# EAGLE schematic 612_jetracer_esp32s3_030004 (EAGLE 9.6.2)
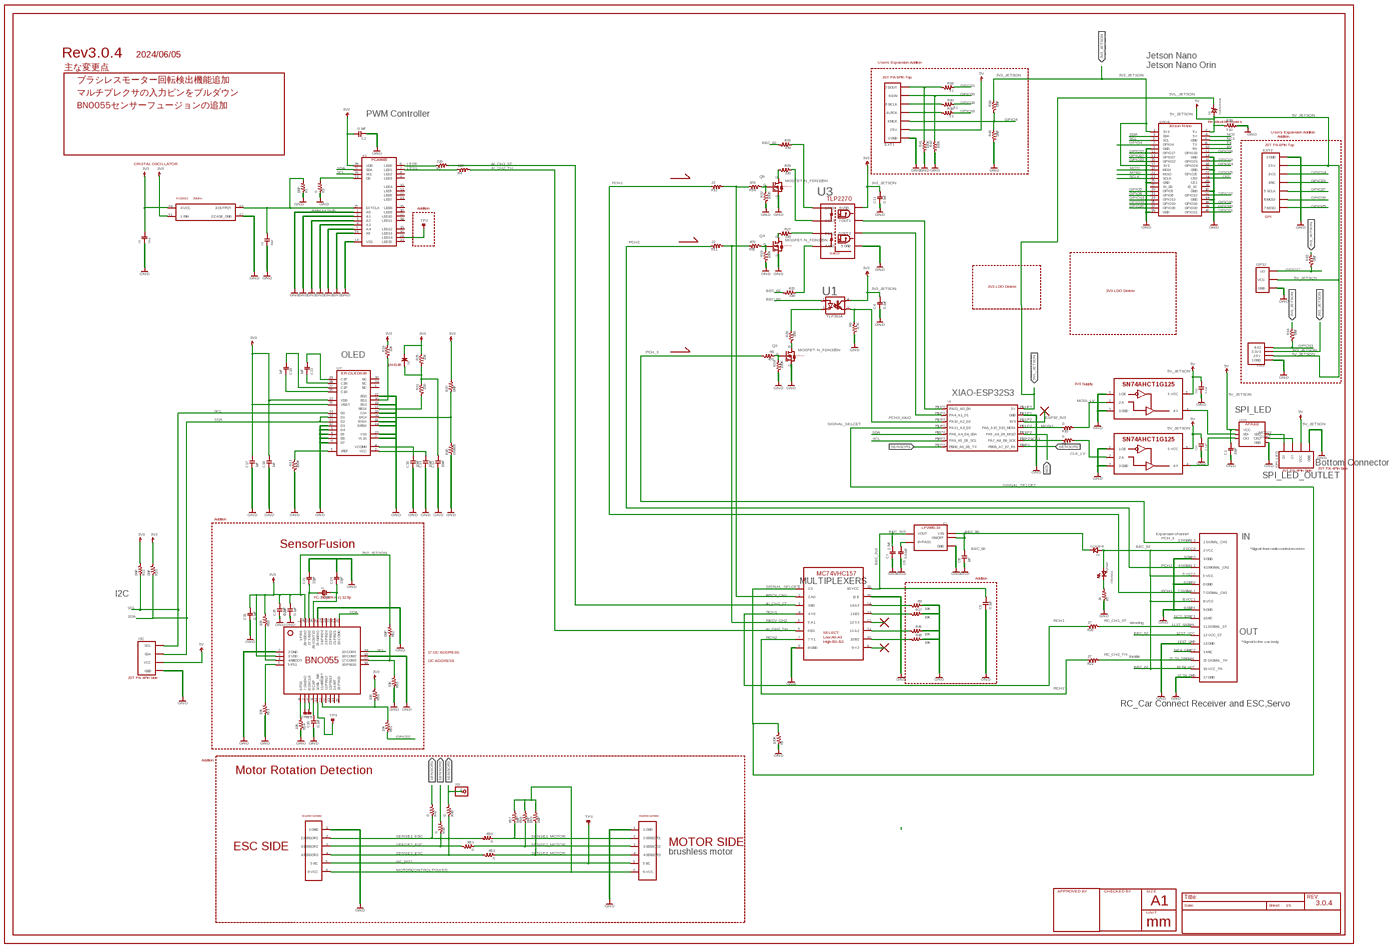
[diagram p0: schematic, sheet 1, overview]
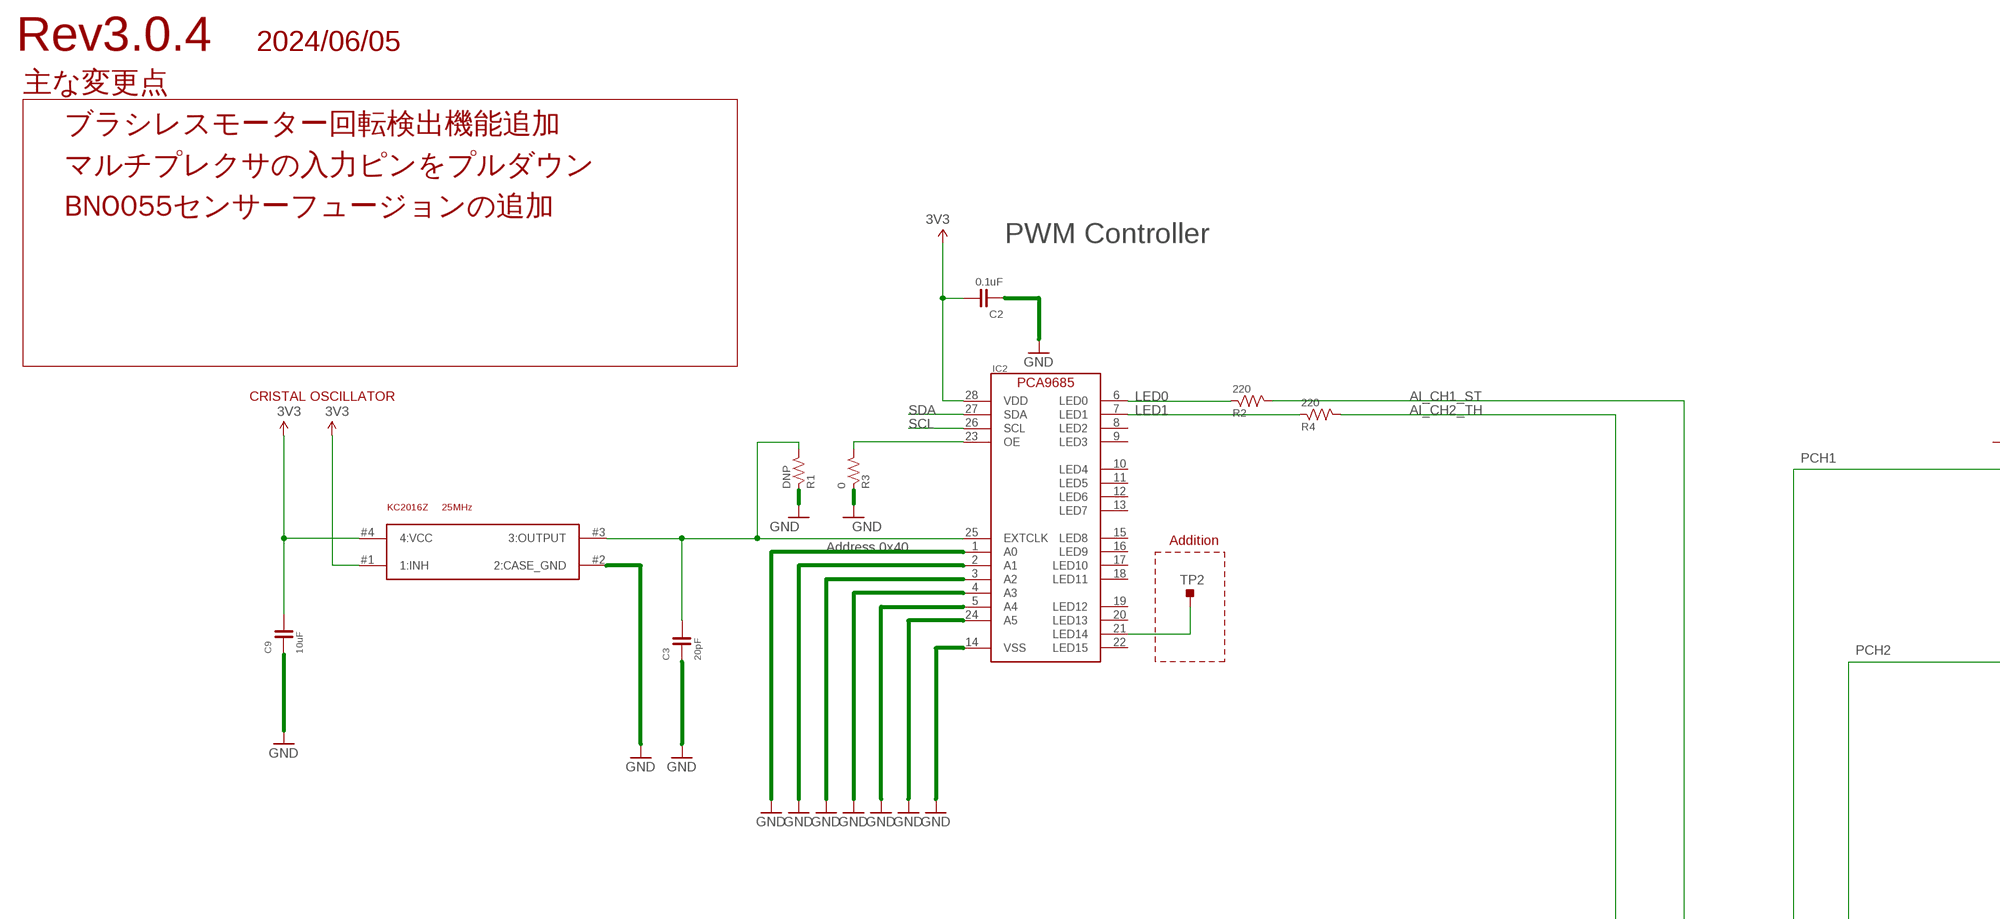
[diagram p1: schematic, sheet 1, part 1 of 4]
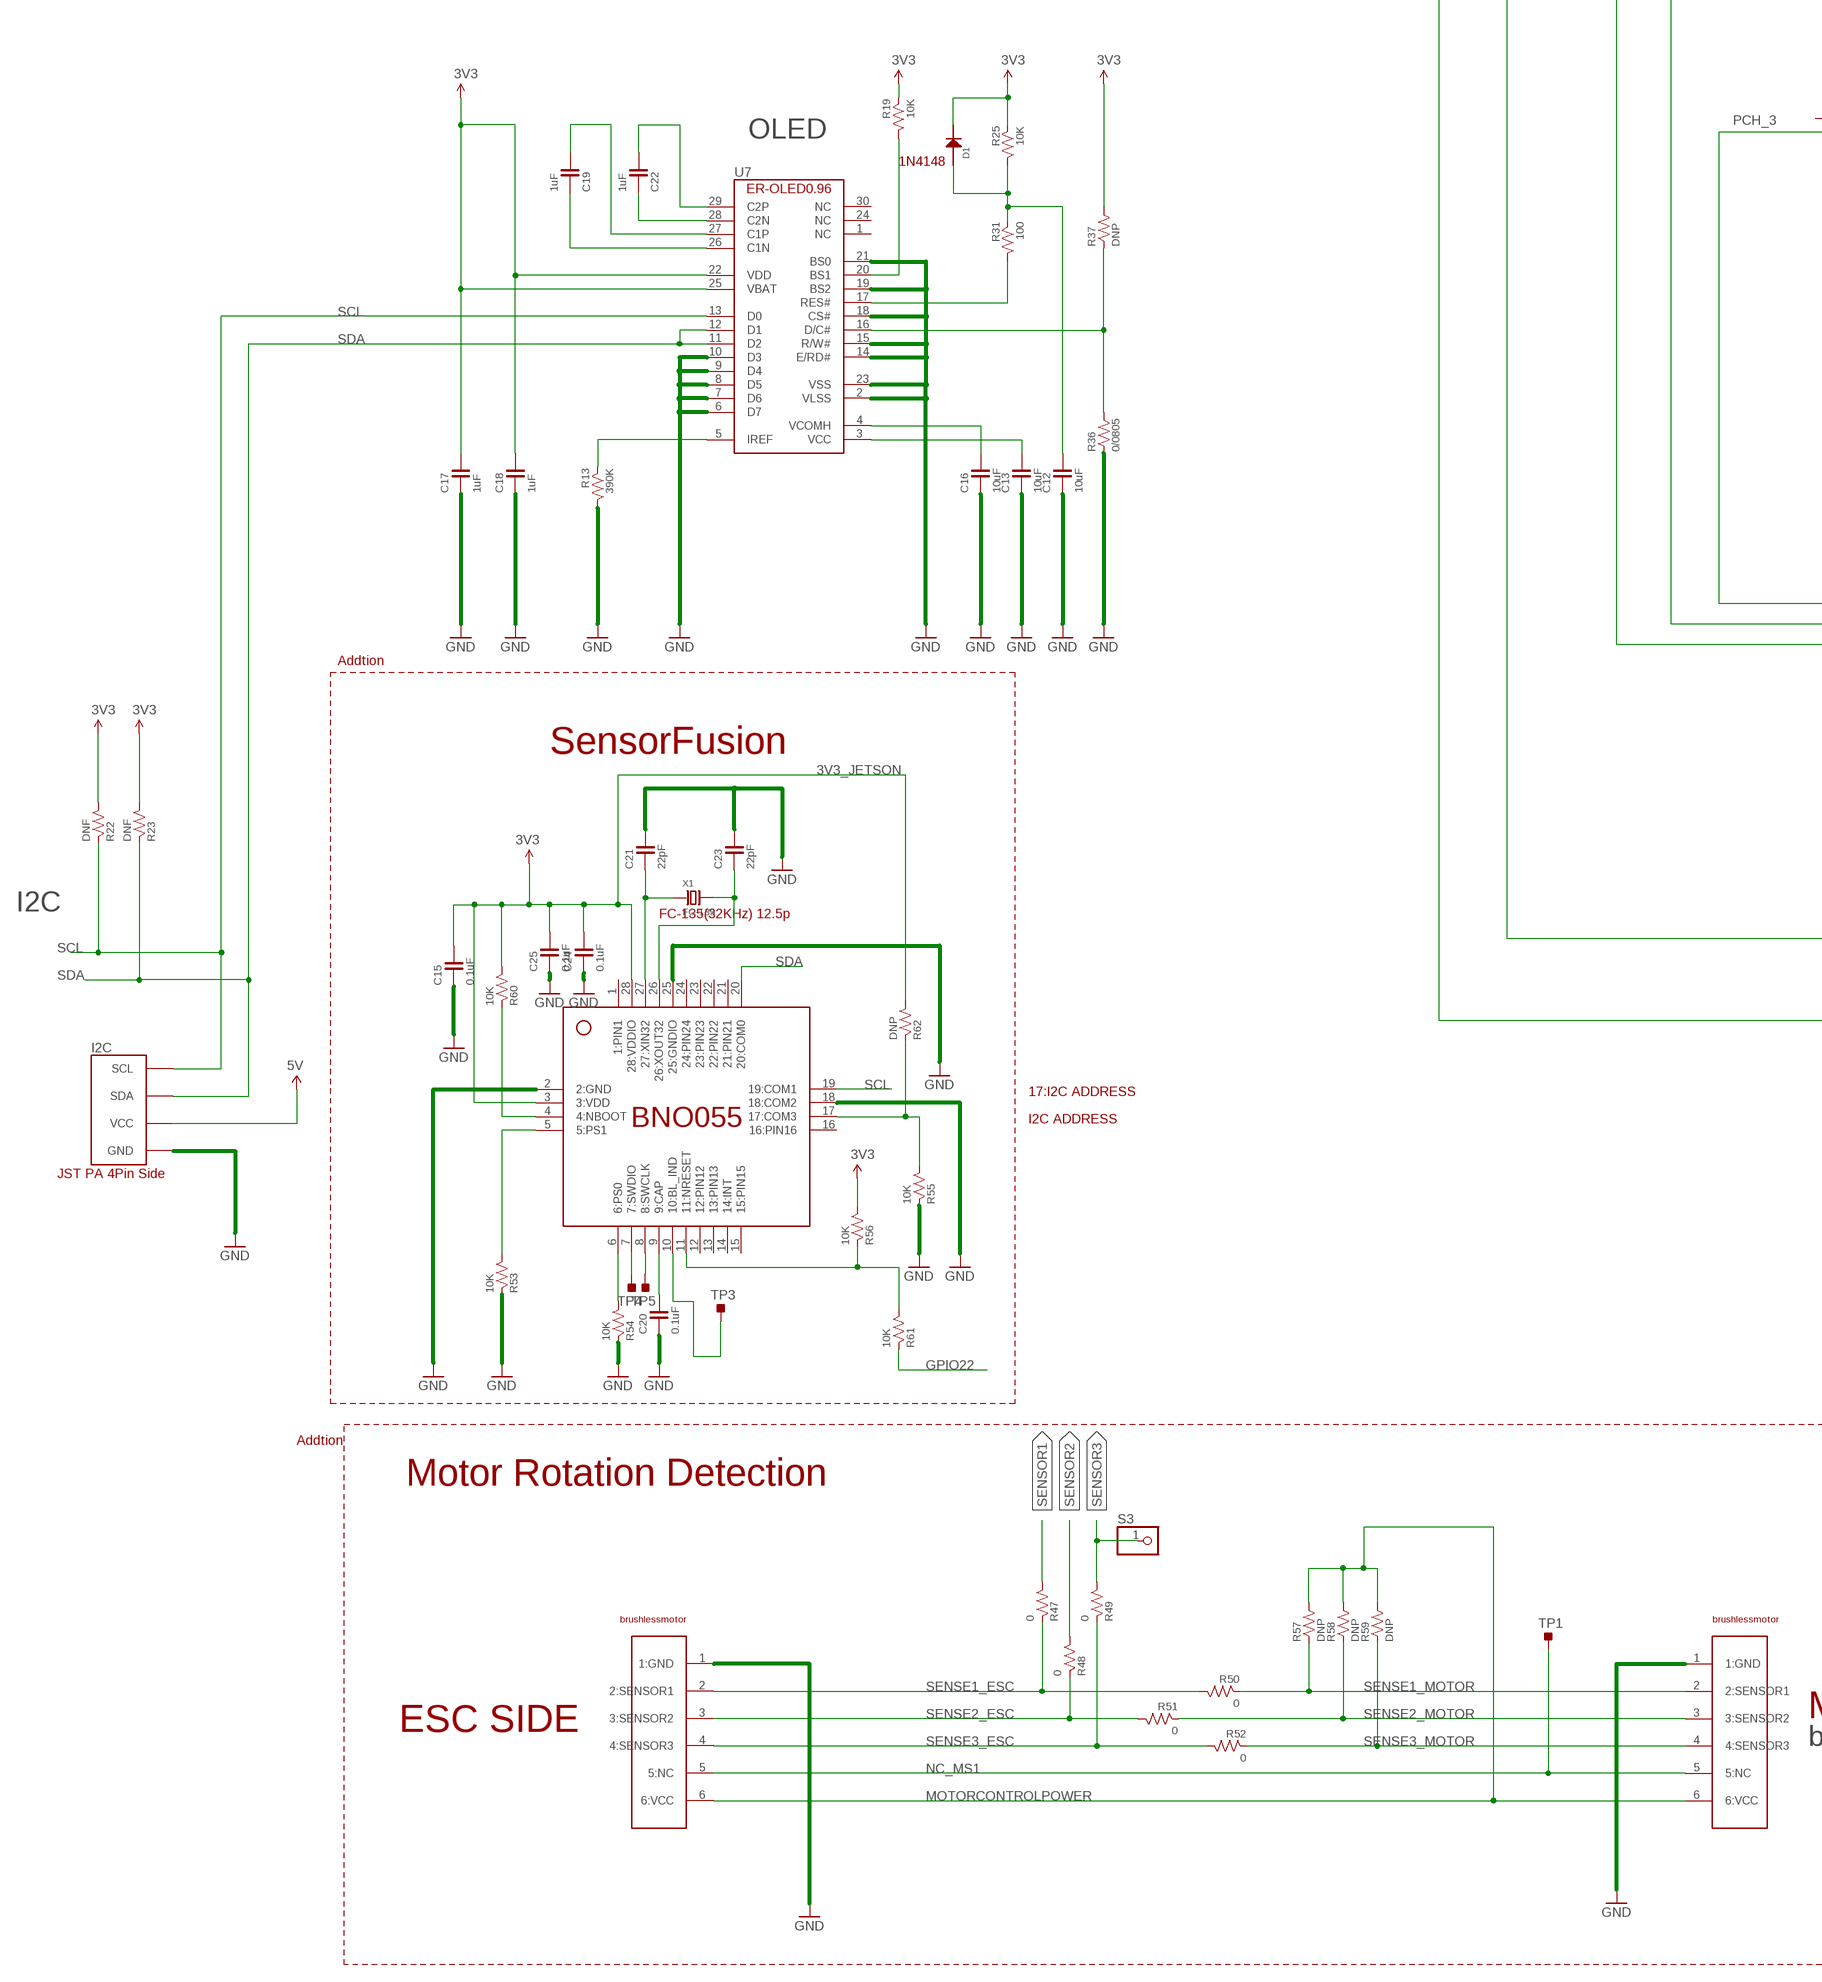
[diagram p2: schematic, sheet 1, part 2 of 4]
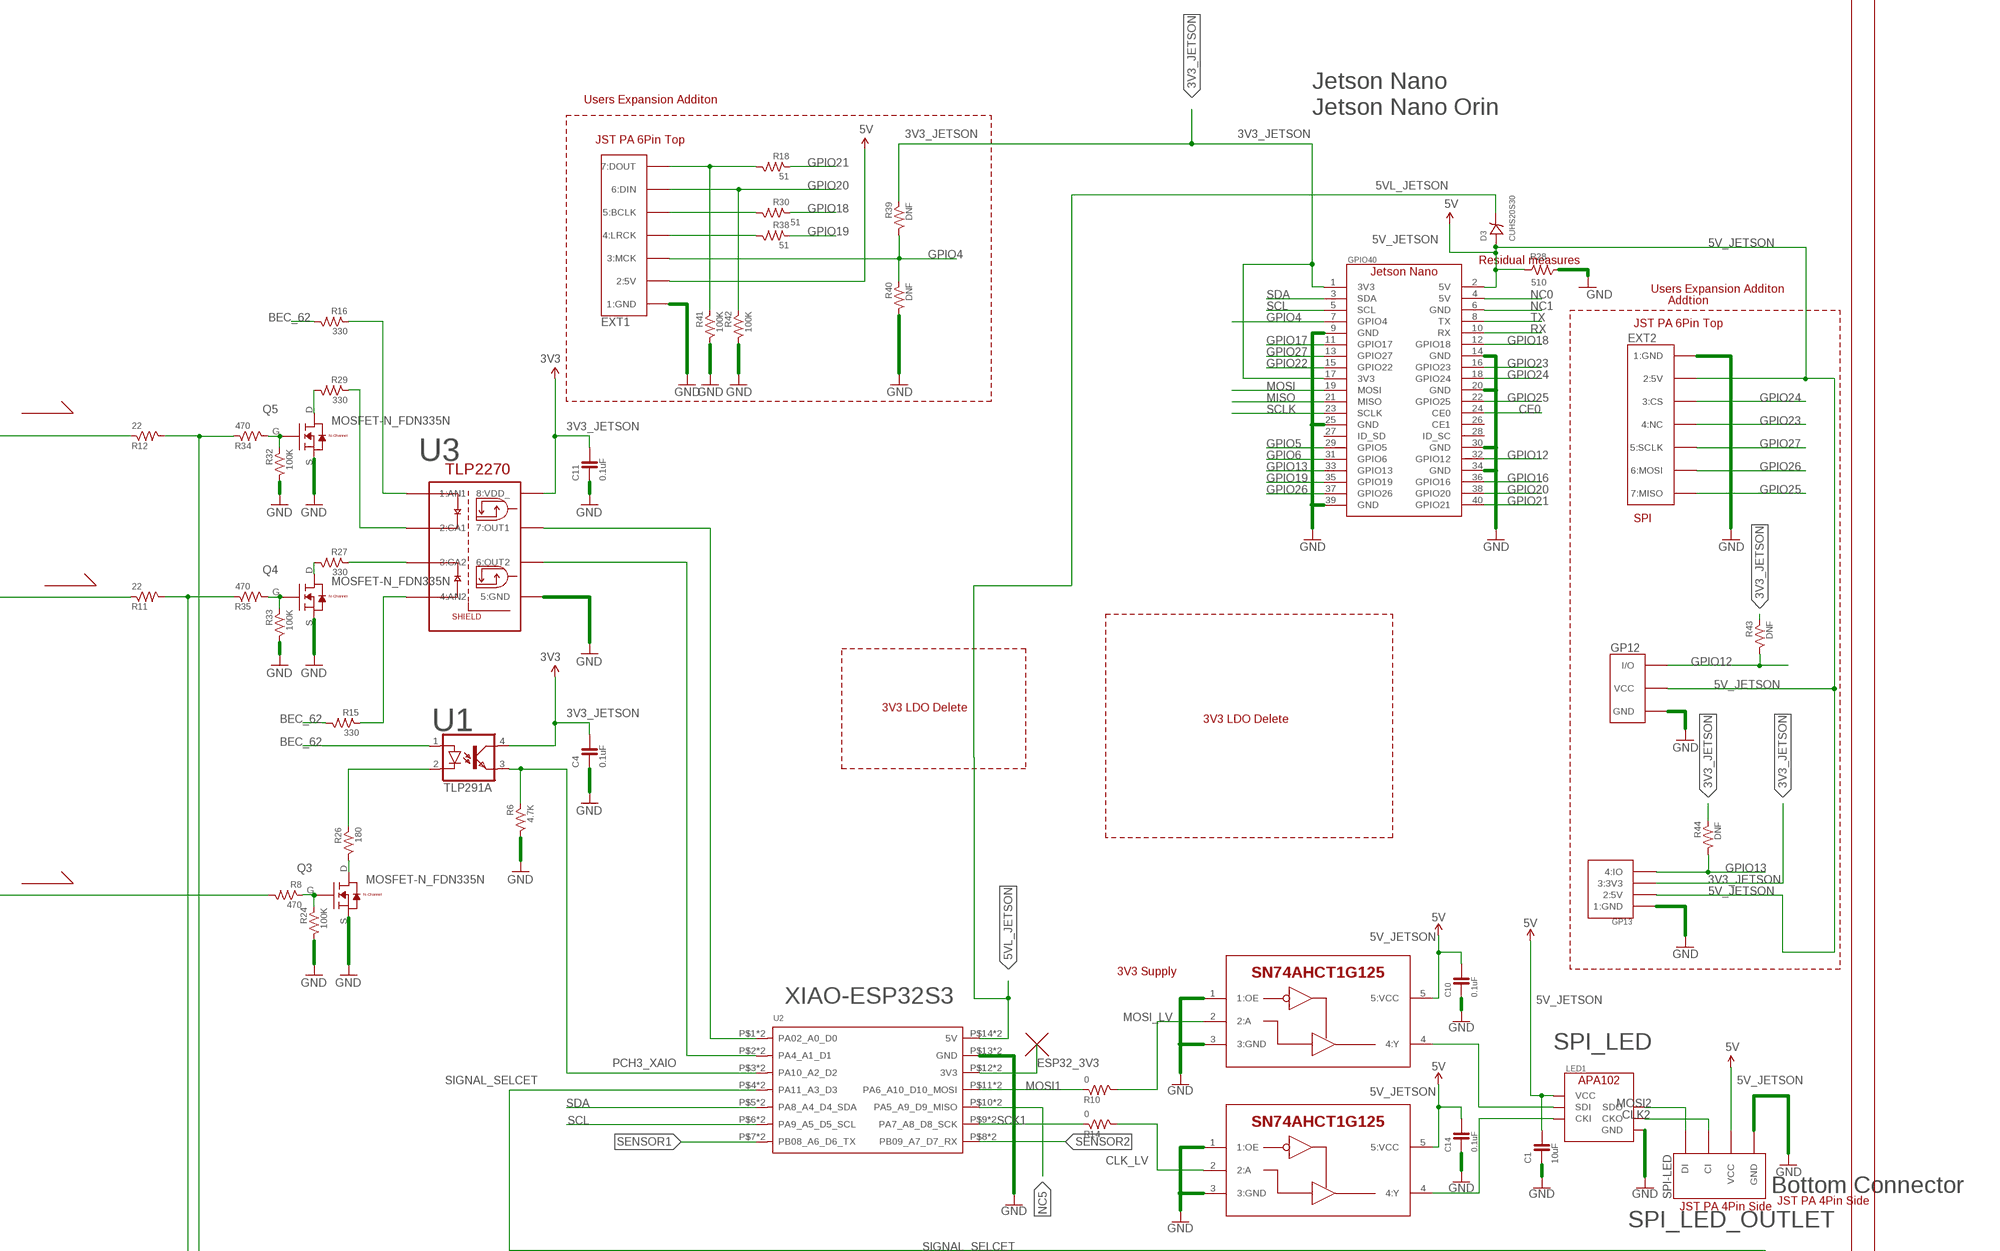
[diagram p3: schematic, sheet 1, part 3 of 4]
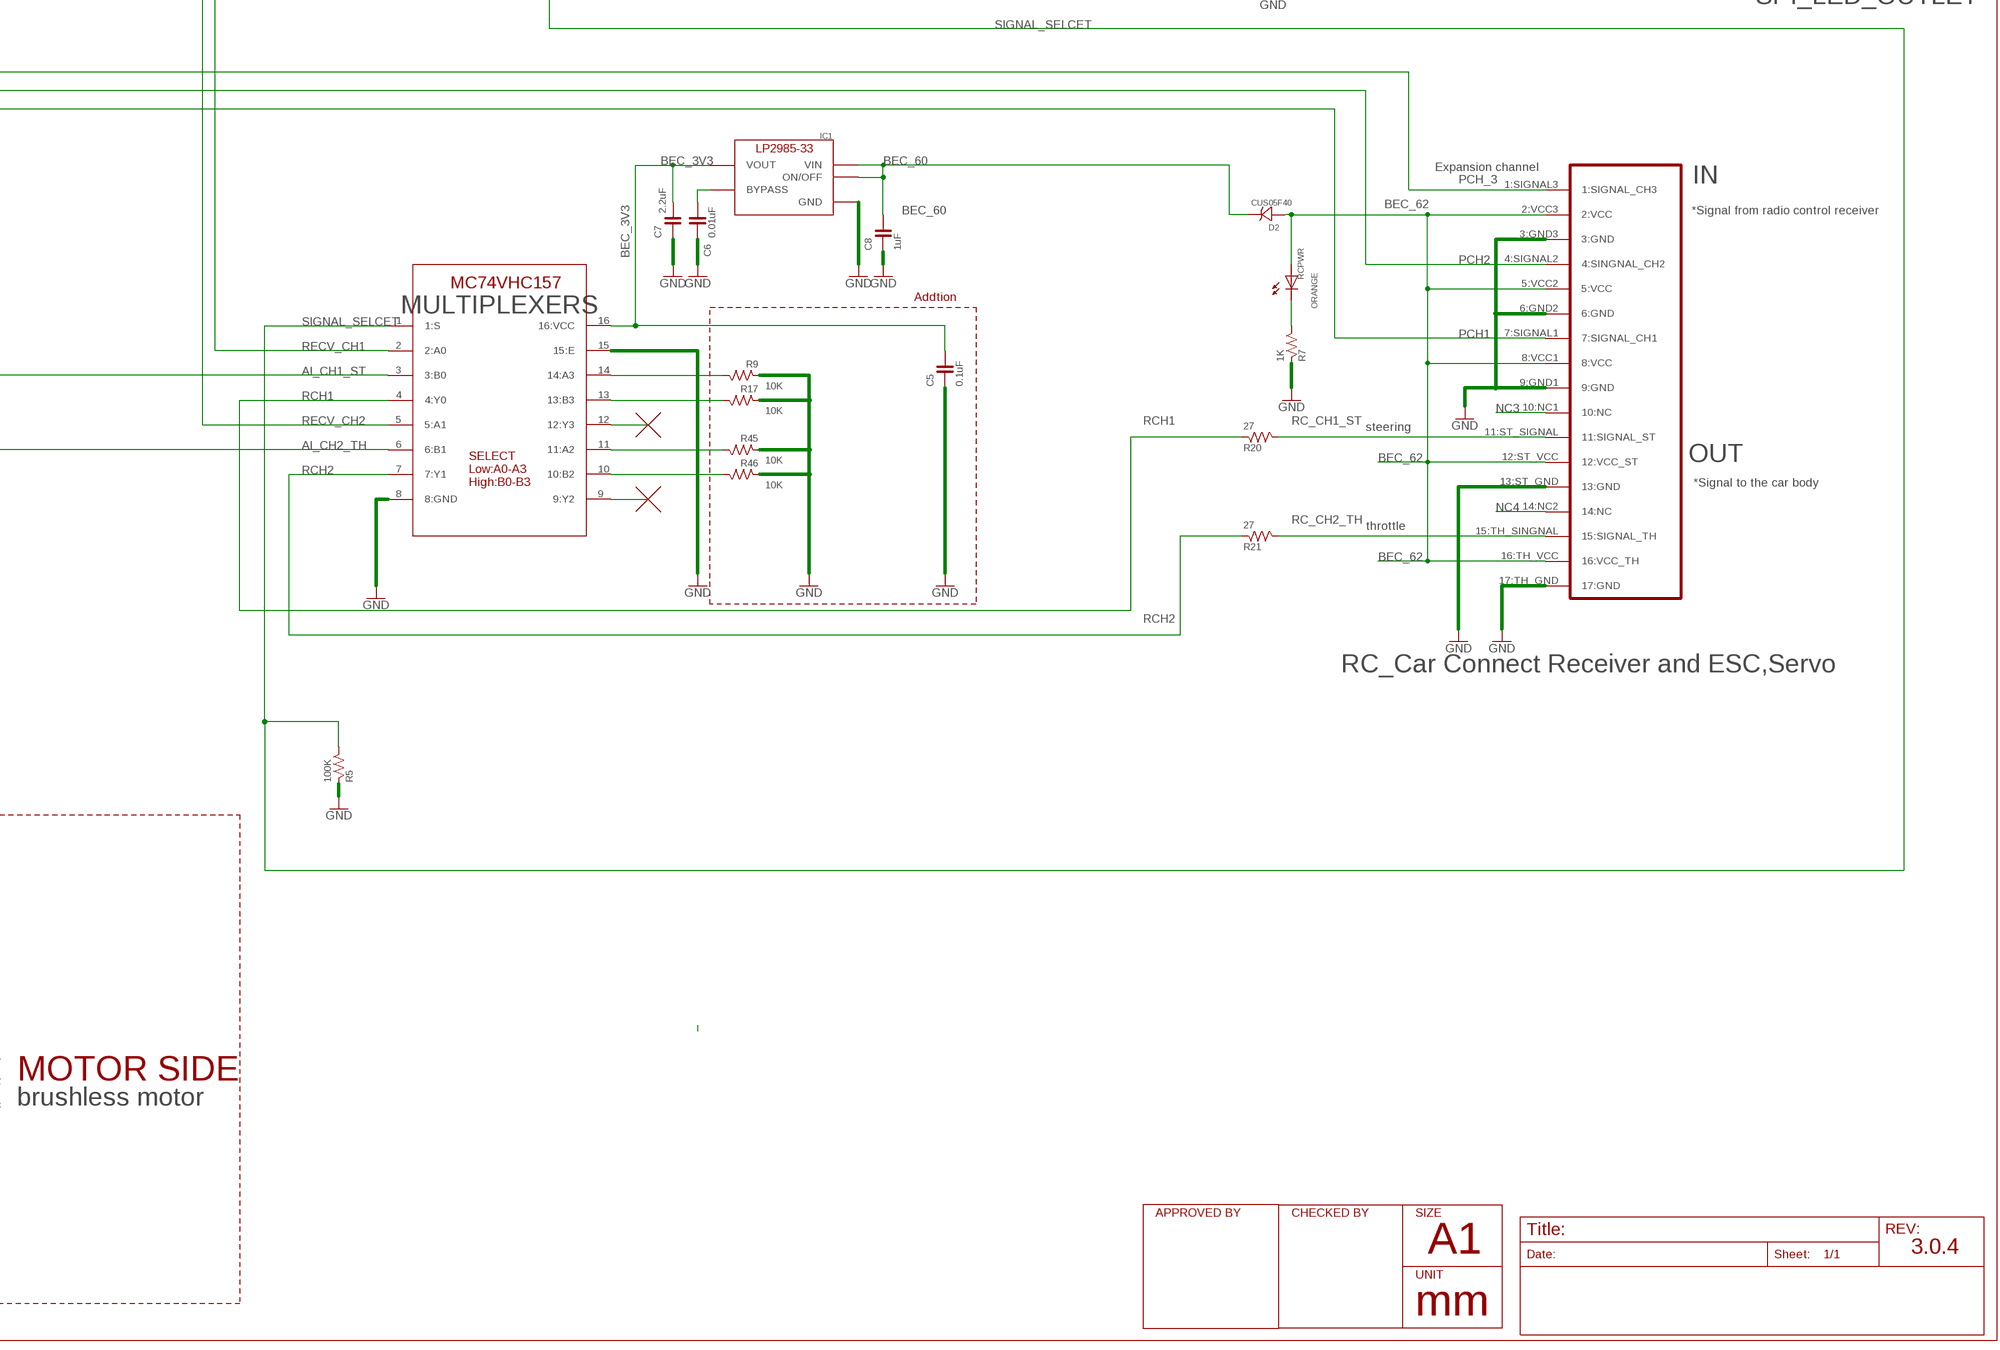
[diagram p4: schematic, sheet 1, part 4 of 4]

## Parts
C1  10uF  CAPACITOR-0603  [0603]
C2  0.1uF  CAPACITOR-0603  [0603]
C3  20pF  CAPACITOR-0402  [0402]
C4  0.1uF  CAPACITOR-0603  [0603]
C5  0.1uF  CAPACITOR-0603  [0603]
C6  0.01uF  CAPACITOR-0603  [0603]
C7  2.2uF  CAPACITOR-0603  [0603]
C8  1uF  CAPACITOR-0603  [0603]
C9  10uF  CAPACITOR-0402  [0402]
C10  0.1uF  CAPACITOR-0402  [0402]
C11  0.1uF  CAPACITOR-0603  [0603]
C12  10uF  CAPACITOR-0603  [0603]
C13  10uF  CAPACITOR-0603  [0603]
C14  0.1uF  CAPACITOR-0402  [0402]
C15  0.1uF  CAPACITOR-0402  [0402]
C16  10uF  CAPACITOR-0603  [0603]
C17  1uF  CAPACITOR-0603  [0603]
C18  1uF  CAPACITOR-0603  [0603]
C19  1uF  CAPACITOR-0603  [0603]
C20  0.1uF  CAPACITOR-0402  [0402]
C21  22pF  CAPACITOR-0402  [0402]
C22  1uF  CAPACITOR-0603  [0603]
C23  22pF  CAPACITOR-0402  [0402]
C24  0.1uF  CAPACITOR-0402  [0402]
C25  0.1uF  CAPACITOR-0402  [0402]
D1  1N4148  [1N4148W]
D2  CUS05F40  [CUS05F40]
D3  CUHS20S30  [US2H]
ESC_CON  BRUSHLESSMOTOR_CON  [B6B-ZR]
EXT1  FABO-I2S-7PIN  [SPI-B07B-PASK-1]
EXT2  FABO-SPI-7PIN  [SPI-B07B-PASK-1]
GP12  FABO_BRICK_3PIN-B03B-PASK-1  [FABO_BRICK_3PIN_B03B-PASK-1]
GP13  FABO-GPIO-2G  [GPIO-B04B-PASK-1]
GPIO40  JETSON_NANOJETSON_NANO_OVERALL  [JETSON_NANO_DEMENTION]
I2C  FABO-I2C  [I2C-SM04B-PASS-1-FL]
IC1  LP2985-33DBVR  [SOT-23-5]
IC2  PCA9685PW,BS  [PCA9685]
LED1  APA102_IPIXEL  [APA102_2020]
MOTOR  BRUSHLESSMOTOR_CON  [B6B-ZR]
Q3  MOSFET-N_FDN335N  [SUPERSOT-3]
Q4  MOSFET-N_FDN335N  [SUPERSOT-3]
Q5  MOSFET-N_FDN335N  [SUPERSOT-3]
R1  DNP  RESISTOR-0603  [0603]
R2  220  RESISTOR-0603  [0603]
R3  0  RESISTOR-0603  [0603]
R4  220  RESISTOR-0603  [0603]
R5  100K  RESISTOR-0603  [0603]
R6  4.7K  RESISTOR-0603  [0603]
R7  1K  RESISTOR-0603  [0603]
R8  470  RESISTOR-0603  [0603]
R9  10K  RESISTOR-0603  [0603]
R10  0  RESISTOR-0603  [0603]
R11  22  RESISTOR-0603  [0603]
R12  22  RESISTOR-0603  [0603]
R13  390K  RESISTOR-0603  [0603]
R14  0  RESISTOR-0603  [0603]
R15  330  RESISTOR-0603  [0603]
R16  330  RESISTOR-0603  [0603]
R17  10K  RESISTOR-0603  [0603]
R18  51  RESISTOR-0603  [0603]
R19  10K  RESISTOR-0603  [0603]
R20  27  RESISTOR-0603  [0603]
R21  27  RESISTOR-0603  [0603]
R22  DNF  RESISTOR-0603  [0603]
R23  DNF  RESISTOR-0603  [0603]
R24  100K  RESISTOR-0603  [0603]
R25  10K  RESISTOR-0603  [0603]
R26  180  RESISTOR-0603  [0603]
R27  330  RESISTOR-0603  [0603]
R28  510  RESISTOR-0805  [0805]
R29  330  RESISTOR-0603  [0603]
R30  51  RESISTOR-0603  [0603]
R31  100  RESISTOR-0603  [0603]
R32  100K  RESISTOR-0603  [0603]
R33  100K  RESISTOR-0603  [0603]
R34  470  RESISTOR-0603  [0603]
R35  470  RESISTOR-0603  [0603]
R36  0/0805  RESISTOR-0805  [0805]
R37  DNP  RESISTOR-0805  [0805]
R38  51  RESISTOR-0603  [0603]
R39  DNF  RESISTOR-0603  [0603]
R40  DNF  RESISTOR-0603  [0603]
R41  100K  RESISTOR-0603  [0603]
R42  100K  RESISTOR-0603  [0603]
R43  DNF  RESISTOR-0603  [0603]
R44  DNF  RESISTOR-0603  [0603]
R45  10K  RESISTOR-0603  [0603]
R46  10K  RESISTOR-0603  [0603]
R47  0  RESISTOR-0603  [0603]
R48  0  RESISTOR-0603  [0603]
R49  0  RESISTOR-0603  [0603]
R50  0  RESISTOR-0603  [0603]
R51  0  RESISTOR-0603  [0603]
R52  0  RESISTOR-0603  [0603]
R53  10K  RESISTOR-0402  [0402]
R54  10K  RESISTOR-0402  [0402]
R55  10K  RESISTOR-0402  [0402]
R56  10K  RESISTOR-0402  [0402]
R57  DNP  RESISTOR-0402  [0402]
R58  DNP  RESISTOR-0402  [0402]
R59  DNP  RESISTOR-0402  [0402]
R60  10K  RESISTOR-0402  [0402]
R61  10K  RESISTOR-0402  [0402]
R62  DNP  RESISTOR-0402  [0402]
RCPWR  ORANGE  LED-0603  [0603]
S3  PINHD-1X1  [1X01]
SPI-LED  FABO-SPI-LED  [SPI-SM04B-PASS-1-FL]
TP1  TESTPOINT_TPS-SMD-10SN  [TESTPOINT_SMD-10SN]
TP2  TESTPOINT_TPS-SMD-10SN  [TESTPOINT_SMD-10SN]
TP3  TESTPOINT_TPS-SMD-10SN  [TESTPOINT_SMD-10SN]
TP4  TESTPOINT_TPS-SMD-10SN  [TESTPOINT_SMD-10SN]
TP5  TESTPOINT_TPS-SMD-10SN  [TESTPOINT_SMD-10SN]
U1  TLP291A  [11-3C1]
U2  MOUDLE-SEEEDUINO-XIAO-ESP32C3  [MOUDLE14P-DIP]
U3  TLP2270  [TLP2270]
U7  ER-OLED0.96-1ER-CON30HT-1  [ER-CON30HT-1]
U$1  RC_17PIN_OUTIN  [PNHEADER_2.54_SMT_17PIN_RC_TT01_02]
U$3  MC74VHC157  [MC74VHC157_TSSOP-16]
U$9  SN74AHCT1G125  [SOT-1DOT1]
U$10  SN74AHCT1G125  [SOT-1DOT1]
U$11  KC2016Z  [KC2016Z]
U$13  BNO055  [LGA]
X1  FC-135  [FC-135]

## Nets
3V3_JETSON: C2.2 C4.2 C9.2 C11.2 C15.2 C17.2 C18.2 C24.2 C25.2 D1.CATHODE GP13.3V3(3:3V3) GPIO40.1(3V3) GPIO40.17(3V3) IC2.28(VDD) R19.1 R22.2 R23.2 R25.1 R37.2 R39.1 R43.1 R44.1 R56.2 R60.2 R62.2 U1.4(COL) U3.8(8:VDD_) U7.22(VDD) U7.25(VBAT) U$11.#1(1:INH) U$11.#4(4:VCC) U$13.3(3:VDD) U$13.28(28:VDDIO) ; supply symbol labelled 3V3
5V_JETSON: C1.2 C10.2 C14.2 D3.A(ANODE) EXT1.2(2:5V) EXT2.2(2:5V) GP12.VCC GP13.5V(2:5V) GPIO40.2(5V) I2C.5V(VCC) LED1.VCC R28.2 SPI-LED.5V(VCC) U$9.5(5:VCC) U$10.5(5:VCC) ; supply symbol labelled 5V
5VL_JETSON: D3.K(CATHODE) U2.P$14(5V) U2.P$28(5V)
AI_CH1_ST: R2.2 U$3.3(3:B0)
AI_CH2_TH: R4.2 U$3.6(6:B1)
BEC_3V3: C5.2 C7.2 IC1.5(VOUT) U$3.16(16:VCC)
BEC_60: C8.2 D2.C(CATHODE) IC1.1(VIN) IC1.3(ON/OFF)
BEC_62: D2.A(ANODE) R15.2 R16.2 RCPWR.ANODE U1.1(A) U$1.2:VCC3(2:VCC) U$1.5:VCC2(5:VCC) U$1.8:VCC1(8:VCC) U$1.12:ST_VCC(12:VCC_ST) U$1.16:TH_VCC(16:VCC_TH)
BNO_RESET: R56.1 R61.2 U$13.11(11:NRESET)
CE0: GPIO40.24(CE0)
CLK2: LED1.CKO SPI-LED.CI
CLK_HV: LED1.CKI U$10.4(4:Y)
CLK_LV: R14.2 U$10.2(2:A)
ESP32_3V3: U2.P$12(3V3) U2.P$26(3V3)
G18: EXT1.5(5:BCLK) R30.2
G19: EXT1.4(4:LRCK) R38.2
G21: EXT1.7(7:DOUT) R18.2 R41.1
GND: C1.1 C2.1 C3.1 C4.1 C5.1 C6.1 C7.1 C8.1 C9.1 C10.1 C11.1 C12.1 C13.1 C14.1 C15.1 C16.1 C17.1 C18.1 C20.1 C21.2 C23.2 C24.1 C25.1 ESC_CON.1(1:GND) EXT1.1(1:GND) EXT2.1(1:GND) GP12.GND GP13.GND(1:GND) GPIO40.9(GND) GPIO40.14(GND) GPIO40.20(GND) GPIO40.25(GND) GPIO40.30(GND) GPIO40.34(GND) GPIO40.39(GND) I2C.GND IC1.2(GND) IC2.1(A0) IC2.2(A1) IC2.3(A2) IC2.4(A3) IC2.5(A4) IC2.14(VSS) IC2.24(A5) LED1.GND MOTOR.1(1:GND) Q3.S Q4.S Q5.S R1.1 R3.1 R5.1 R6.2 R7.1 R9.1 R13.2 R17.1 R24.2 R28.1 R32.2 R33.2 R36.1 R40.2 R41.2 R42.2 R45.1 R46.1 R53.1 R54.1 R55.1 SPI-LED.GND U2.P$13(GND) U2.P$27(GND) U3.5(5:GND) U7.2(VLSS) U7.6(D7) U7.7(D6) U7.8(D5) U7.9(D4) U7.10(D3) U7.14(E/RD#) U7.15(R/W#) U7.18(CS#) U7.19(BS2) U7.21(BS0) U7.23(VSS) U$1.3:GND3(3:GND) U$1.6:GND2(6:GND) U$1.9:GND1(9:GND) U$1.13:ST_GND(13:GND) U$1.17:TH_GND(17:GND) U$3.8(8:GND) U$3.15(15:E) U$9.1(1:OE) U$9.3(3:GND) U$10.1(1:OE) U$10.3(3:GND) U$11.#2(2:CASE_GND) U$13.2(2:GND) U$13.18(18:COM2) U$13.25(25:GNDIO)
GPIO4: EXT1.3(3:MCK) GPIO40.7(GPIO4) R39.2 R40.1
GPIO5: GPIO40.29(GPIO5)
GPIO6: GPIO40.31(GPIO6)
GPIO12: GP12.I/O GPIO40.32(GPIO12) R43.2
GPIO13: GP13.IO(4:IO) GPIO40.33(GPIO13) R44.2
GPIO16: GPIO40.36(GPIO16)
GPIO17: GPIO40.11(GPIO17)
GPIO18: GPIO40.12(GPIO18) R30.1
GPIO19: GPIO40.35(GPIO19) R38.1
GPIO20: EXT1.6(6:DIN) GPIO40.38(GPIO20) R42.1
GPIO21: GPIO40.40(GPIO21) R18.1
GPIO22: GPIO40.15(GPIO22) R61.1
GPIO23: EXT2.4(4:NC) GPIO40.16(GPIO23)
GPIO24: EXT2.3(3:CS) GPIO40.18(GPIO24)
GPIO25: EXT2.7(7:MISO) GPIO40.22(GPIO25)
GPIO26: EXT2.6(6:MOSI) GPIO40.37(GPIO26)
GPIO27: EXT2.5(5:SCLK) GPIO40.13(GPIO27)
LED0: IC2.6(LED0) R2.1
LED1: IC2.7(LED1) R4.1
MISO: GPIO40.21(MISO)
MOSI: GPIO40.19(MOSI)
MOSI1: R10.1 U2.P$11(PA6_A10_D10_MOSI) U2.P$25(PA6_A10_D10_MOSI)
MOSI2: LED1.SDO SPI-LED.DI
MOSI_HV: LED1.SDI U$9.4(4:Y)
MOSI_LV: R10.2 U$9.2(2:A)
MOTORCONTROLPOWER: ESC_CON.6(6:VCC) MOTOR.6(6:VCC) R57.2 R58.2 R59.2
N$2: U$3.9(9:Y2)
N$3: C22.2 U7.29(C2P)
N$4: R46.2 U$3.10(10:B2)
N$5: U2.P$1(PA02_A0_D0) U2.P$15(PA02_A0_D0) U3.7(7:OUT1)
N$6: R26.1 U1.2(C)
N$7: IC2.23(OE) R3.2
N$8: U2.P$2(PA4_A1_D1) U2.P$16(PA4_A1_D1) U3.6(6:OUT2)
N$9: R15.1 U3.4(4:AN2)
N$10: IC2.21(LED14) TP2.TP
N$11: R60.1 U$13.4(4:NBOOT)
N$12: R16.1 U3.1(1:AN1)
N$13: TP3.TP U$13.10(10:BL_IND)
N$14: R13.1 U7.5(IREF)
N$15: C20.2 U$13.9(9:CAP)
N$16: C19.2 U7.27(C1P)
N$17: C13.2 U7.3(VCC)
N$18: R31.2 U7.17(RES#)
N$19: R45.2 U$3.11(11:A2)
N$20: U$3.12(12:Y3)
N$21: C19.1 U7.26(C1N)
N$22: C22.1 U7.28(C2N)
N$23: Q3.G R8.1 R24.1
N$24: R7.2 RCPWR.CATHODE
N$25: C16.2 U7.4(VCOMH)
N$26: Q3.D R26.2
N$27: Q4.D R27.2
N$28: R27.1 U3.3(3:CA2)
N$29: Q5.D R29.2
N$30: R29.1 U3.2(2:CA1)
N$31: R17.2 U$3.13(13:B3)
N$32: C12.2 D1.ANODE R25.2 R31.1
N$33: Q5.G R32.1 R34.2
N$34: C21.1 U$13.27(27:XIN32) X1.1
N$35: R9.2 U$3.14(14:A3)
N$36: C23.1 U$13.26(26:XOUT32) X1.2
N$37: R36.2 R37.1 U7.16(D/C#)
N$38: Q4.G R33.1 R35.2
N$40: C6.2 IC1.4(BYPASS)
N$41: C3.2 IC2.25(EXTCLK) R1.2 U$11.#3(3:OUTPUT)
N$42: TP4.TP U$13.7(7:SWDIO)
N$43: R54.2 U$13.6(6:PS0)
N$44: R53.2 U$13.5(5:PS1)
N$45: R55.2 R62.1 U$13.17(17:COM3)
N$46: TP5.TP U$13.8(8:SWCLK)
N$50: R19.2 U7.20(BS1)
NC0: GPIO40.4(5V)
NC1: GPIO40.6(GND)
NC3: U$1.10:NC1(10:NC)
NC4: U$1.14:NC2(14:NC)
NC5: U2.P$10(PA5_A9_D9_MISO) U2.P$24(PA5_A9_D9_MISO)
NC_MS1: ESC_CON.5(5:NC) MOTOR.5(5:NC) TP1.TP
PCH1: R12.1 U$1.7:SIGNAL1(7:SIGNAL_CH1)
PCH2: R11.1 U$1.4:SIGNAL2(4:SINGNAL_CH2)
PCH3_XAIO: R6.1 U1.3(EMI) U2.P$3(PA10_A2_D2) U2.P$17(PA10_A2_D2)
PCH_3: R8.2 U$1.1:SIGNAL3(1:SIGNAL_CH3)
RC_CH1_ST: R20.2 U$1.11:ST_SIGNAL(11:SIGNAL_ST)
RC_CH2_TH: R21.2 U$1.15:TH_SINGNAL(15:SIGNAL_TH)
RCH1: R20.1 U$3.4(4:Y0)
RCH2: R21.1 U$3.7(7:Y1)
RECV_CH1: R12.2 R34.1 U$3.2(2:A0)
RECV_CH2: R11.2 R35.1 U$3.5(5:A1)
RX: GPIO40.10(RX)
SCK1: R14.1 U2.P$9(PA7_A8_D8_SCK) U2.P$23(PA7_A8_D8_SCK)
SCL: GPIO40.5(SCL) I2C.SCL IC2.26(SCL) R22.1 U2.P$6(PA9_A5_D5_SCL) U2.P$20(PA9_A5_D5_SCL) U7.13(D0) U$13.19(19:COM1)
SCLK: GPIO40.23(SCLK)
SDA: GPIO40.3(SDA) I2C.SDA IC2.27(SDA) R23.1 U2.P$5(PA8_A4_D4_SDA) U2.P$19(PA8_A4_D4_SDA) U7.11(D2) U7.12(D1) U$13.20(20:COM0)
SENSE1_ESC: ESC_CON.2(2:SENSOR1) R47.1 R50.2
SENSE1_MOTOR: MOTOR.2(2:SENSOR1) R50.1 R57.1
SENSE2_ESC: ESC_CON.3(3:SENSOR2) R48.1 R51.2
SENSE2_MOTOR: MOTOR.3(3:SENSOR2) R51.1 R58.1
SENSE3_ESC: ESC_CON.4(4:SENSOR3) R49.1 R52.2
SENSE3_MOTOR: MOTOR.4(4:SENSOR3) R52.1 R59.1
SENSOR1: R47.2 U2.P$7(PB08_A6_D6_TX) U2.P$21(PB08_A6_D6_TX)
SENSOR2: R48.2 U2.P$8(PB09_A7_D7_RX) U2.P$22(PB09_A7_D7_RX)
SENSOR3: R49.2 S3.1
SIGNAL_SELCET: R5.2 U2.P$4(PA11_A3_D3) U2.P$18(PA11_A3_D3) U$3.1(1:S)
TX: GPIO40.8(TX)
Unconnected: GPIO40.26(CE1) GPIO40.27(ID_SD) GPIO40.28(ID_SC) IC2.8(LED2) IC2.9(LED3) IC2.10(LED4) IC2.11(LED5) IC2.12(LED6) IC2.13(LED7) IC2.15(LED8) IC2.16(LED9) IC2.17(LED10) IC2.18(LED11) IC2.19(LED12) IC2.20(LED13) IC2.22(LED15) U7.1(NC) U7.24(NC) U7.30(NC) U$13.1(1:PIN1) U$13.12(12:PIN12) U$13.13(13:PIN13) U$13.14(14:INT) U$13.15(15:PIN15) U$13.16(16:PIN16) U$13.21(21:PIN21) U$13.22(22:PIN22) U$13.23(23:PIN23) U$13.24(24:PIN24)

## Notes on the sheet
- Rev3.0.4 | 2024/06/05
- Users Expansion Additon
- Jetson Nano
  Jetson Nano Orin
- 主な変更点
- JST PA 6Pin Top
- ブラシレスモーター回転検出機能追加
- マルチプレクサの入力ピンをプルダウン
- BNO055センサーフュージョンの追加
- PWM Controller
- Residual measures
- Users Expansion Additon
- Addtion
- JST PA 6Pin Top
- CRISTAL OSCILLATOR
- Addition
- Address 0x40
- SPI
- 3V3 LDO Delete
- 3V3 LDO Delete
- OLED
- 1N4148
- 3V3 Supply
- XIAO-ESP32S3
- SPI_LED
- Bottom Connector
- JST PA 4Pin Side
- JST PA 4Pin Side
- SPI_LED_OUTLET
- Addtion
- Expansion channel
- IN
- SensorFusion
- *Signal from radio control receiver
- Addtion
- MULTIPLEXERS
- I2C
- FC-135(32KHz) 12.5p
- steering
- OUT
- *Signal to the car body
- SELECT
  Low:A0-A3
  High:B0-B3
- 17:I2C ADDRESS
- throttle
- I2C ADDRESS
- JST PA 4Pin Side
- RC_Car Connect Receiver and ESC,Servo
- Addtion
- Motor Rotation Detection
- MOTOR SIDE
- ESC SIDE
- brushless motor
- 3.0.4

## Library data of the parts
C1-C25 = FaBo-Capacitor:CAPACITOR: CAPACITOR
D1 = FaBo-Diode:1N4148
D2 = FaBo-Diode:CUS05F40
D3 = FaBo-Diode:CUHS20S30: 30V,2A,temp-50~150,if 0.25V(0.5A),rev 170uA(10V)
ESC_CON MOTOR = FaBo-Connetor:BRUSHLESSMOTOR_CON: RCCAR brushless motor Signal
EXT1 = FaBo-Connetor:FABO-I2S-7PIN
EXT2 = FaBo-Connetor:FABO-SPI-7PIN
GP12 = FaBo-Template:FABO_BRICK_3PIN: FaBo Brick 3pin
GP13 = FaBo-Connetor:FABO-GPIO-2G
GPIO40 = FaBo-Boards:JETSON_NANO
I2C = FaBo-Connetor:FABO-I2C
IC1 = FaBo-Supply:LP2985-33DBVR: LP2985
IC2 = FaBo-Motor:PCA9685PW,BS
LED1 = FaBo-LED:APA102
Q3-Q5 = FaBo-Mosfet:MOSFET-N
R1-R36 R38-R61 = FaBo-Resistors:RESISTOR: RESISTOR
R37 R62 = FaBo-Resistors:RESISTOR: RESISTOR; SPICEPREFIX: R
RCPWR = FaBo-LED:LED
S3 = pinhead:PINHD-1X1: PIN HEADER
SPI-LED = FaBo-Connetor:FABO-SPI-LED
TP1-TP5 = 52101-101-REV-A_v16:TESTPOINT_TPS: TEST POINT PAD; BOM: EXCLUDE
U1 = FaBo_Photocoupler:TLP291A
U2 = FaBo-MPU:MOUDLE-SEEEDUINO-XIAO-ESP32C3
U3 = FaBo-Photocoupler:TLP2270
U7 = FaBo-Display:ER-OLED0.96-1: ER-CON30HT-1 Rev2 wide distance 0.23mm
U$1 = FaBo-PIN:RC_17PIN_OUTIN
U$3 = FaBo-Multiplexers:MC74VHC157
U$9 U$10 = FaBo-LogicIC:SN74AHCT1G125: Input TTL logic level level shift
U$11 = FaBo-Crystal:KC2016Z
U$13 = Sensor:BNO055
X1 = FaBo-Crystal:FC-135